# EAGLE design DeviceDIn8 (EAGLE 5.00)
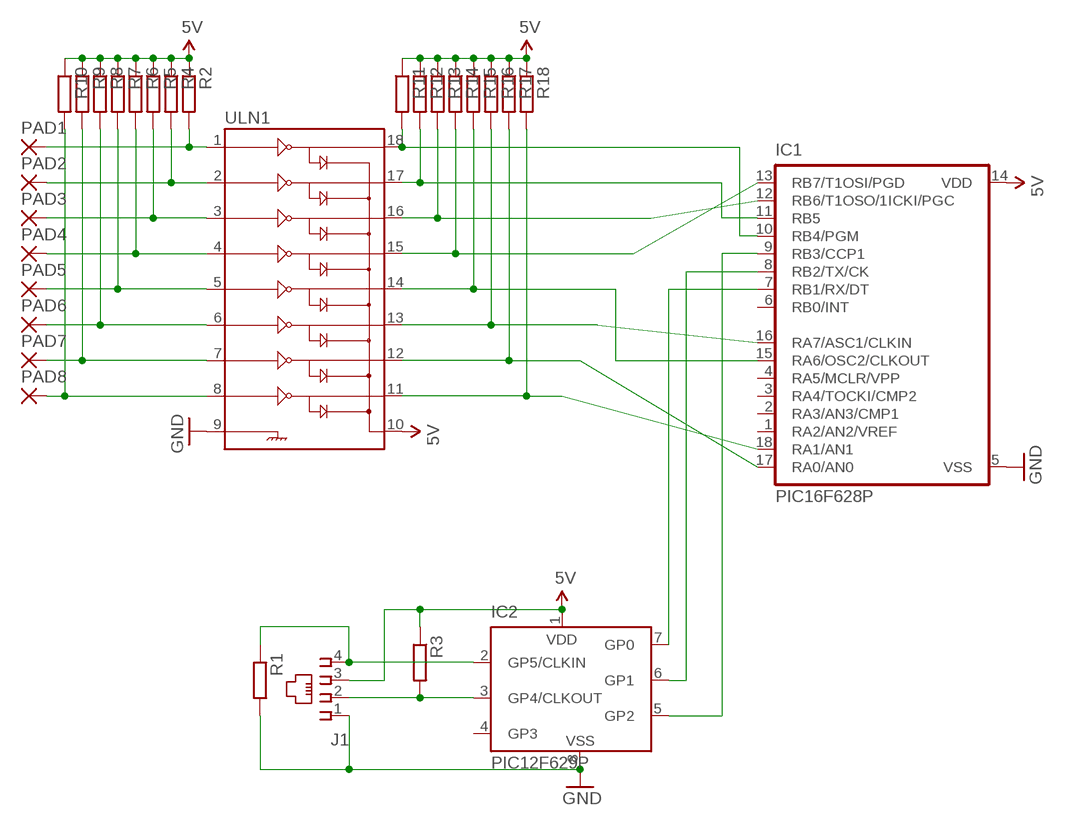
[diagram p0: schematic, sheet 1]

## Parts
IC1  PIC16F628P  [DIL18]
IC2  PIC12F629P  [DIL8]
J1  215875-3  [215875-3]
PAD1  2,15/1,0  [2,15/1,0]
PAD2  2,15/1,0  [2,15/1,0]
PAD3  2,15/1,0  [2,15/1,0]
PAD4  2,15/1,0  [2,15/1,0]
PAD5  2,15/1,0  [2,15/1,0]
PAD6  2,15/1,0  [2,15/1,0]
PAD7  2,15/1,0  [2,15/1,0]
PAD8  2,15/1,0  [2,15/1,0]
R1  R-EU_0204/5  [0204/5]
R2  R-EU_0204/5  [0204/5]
R3  R-EU_0204/5  [0204/5]
R4  R-EU_0204/5  [0204/5]
R5  R-EU_0204/7  [0204/7]
R6  R-EU_0207/10  [0207/10]
R7  R-EU_0207/10  [0207/10]
R8  R-EU_0204/7  [0204/7]
R9  R-EU_0204/5  [0204/5]
R10  R-EU_0204/5  [0204/5]
R11  R-EU_0204/5  [0204/5]
R12  R-EU_0204/5  [0204/5]
R13  R-EU_0204/7  [0204/7]
R14  R-EU_0207/10  [0207/10]
R15  R-EU_0207/10  [0207/10]
R16  R-EU_0204/7  [0204/7]
R17  R-EU_0204/5  [0204/5]
R18  R-EU_0204/5  [0204/5]
ULN1  ULN2803DIP  [DIL18]

## Nets
5V: IC1.14(VDD) IC2.1(VDD) J1.3 R2.1 R3.1 R4.1 R5.1 R6.1 R7.1 R8.1 R9.1 R10.1 R11.1 R12.1 R13.1 R14.1 R15.1 R16.1 R17.1 R18.1 ULN1.10
GND: IC1.5(VSS) IC2.8(VSS) J1.1 R1.2 ULN1.9
N$1: PAD6.1(P) R8.2 ULN1.6
N$2: PAD7.1(P) R9.2 ULN1.7
N$3: PAD1.1(P) R2.2 ULN1.1
N$4: PAD2.1(P) R4.2 ULN1.2
N$5: PAD3.1(P) R5.2 ULN1.3
N$6: PAD4.1(P) R6.2 ULN1.4
N$7: PAD5.1(P) R7.2 ULN1.5
N$8: PAD8.1(P) R10.2 ULN1.8
N$10: IC1.11(RB5) R12.2 ULN1.17
N$11: IC2.3(GP4/CLKOUT) J1.2 R3.2
N$12: IC1.12(RB6/T1OSO/1ICKI/PGC) R13.2 ULN1.16
N$13: IC1.13(RB7/T1OSI/PGD) R14.2 ULN1.15
N$14: IC1.15(RA6/OSC2/CLKOUT) R15.2 ULN1.14
N$15: IC1.16(RA7/ASC1/CLKIN) R16.2 ULN1.13
N$16: IC1.17(RA0/AN0) R17.2 ULN1.12
N$17: IC1.18(RA1/AN1) R18.2 ULN1.11
N$18: IC1.10(RB4/PGM) R11.2 ULN1.18
N$20: IC1.7(RB1/RX/DT) IC2.7(GP0)
N$21: IC1.8(RB2/TX/CK) IC2.6(GP1)
N$22: IC1.9(RB3/CCP1) IC2.5(GP2)
N$25: IC2.2(GP5/CLKIN) J1.4 R1.1
Unconnected: IC1.1(RA2/AN2/VREF) IC1.2(RA3/AN3/CMP1) IC1.3(RA4/TOCKI/CMP2) IC1.4(RA5/MCLR/VPP) IC1.6(RB0/INT) IC2.4(GP3)

## Library data of the parts
IC1 = microchip:PIC16*F62: FLASH-Based 8-Bit CMOS Microcontroller Source: http://ww1.microchip.com/downloads/en/DeviceDoc/40300C.pdf
IC2 = microchip:PIC12F6*: Data Sheet 8-Pin FLASH-Based 8-Bit CMOS Microcontrollers Source: http://www.microchip.com .. 41190c.pdf
J1 = con-amp:215875-3: AMP connector
PAD1-PAD8 = wirepad:2,15/1,0: THROUGH-HOLE PAD
R1-R18 = resistor:R-EU_: RESISTOR, European symbol
ULN1 = SparkFun:ULN2803: Darlington Driver ULN2803 Darlington array. 500mA max per channel, 8-channel package. Spark Fun Electronics SKU : COM-00312

## Board
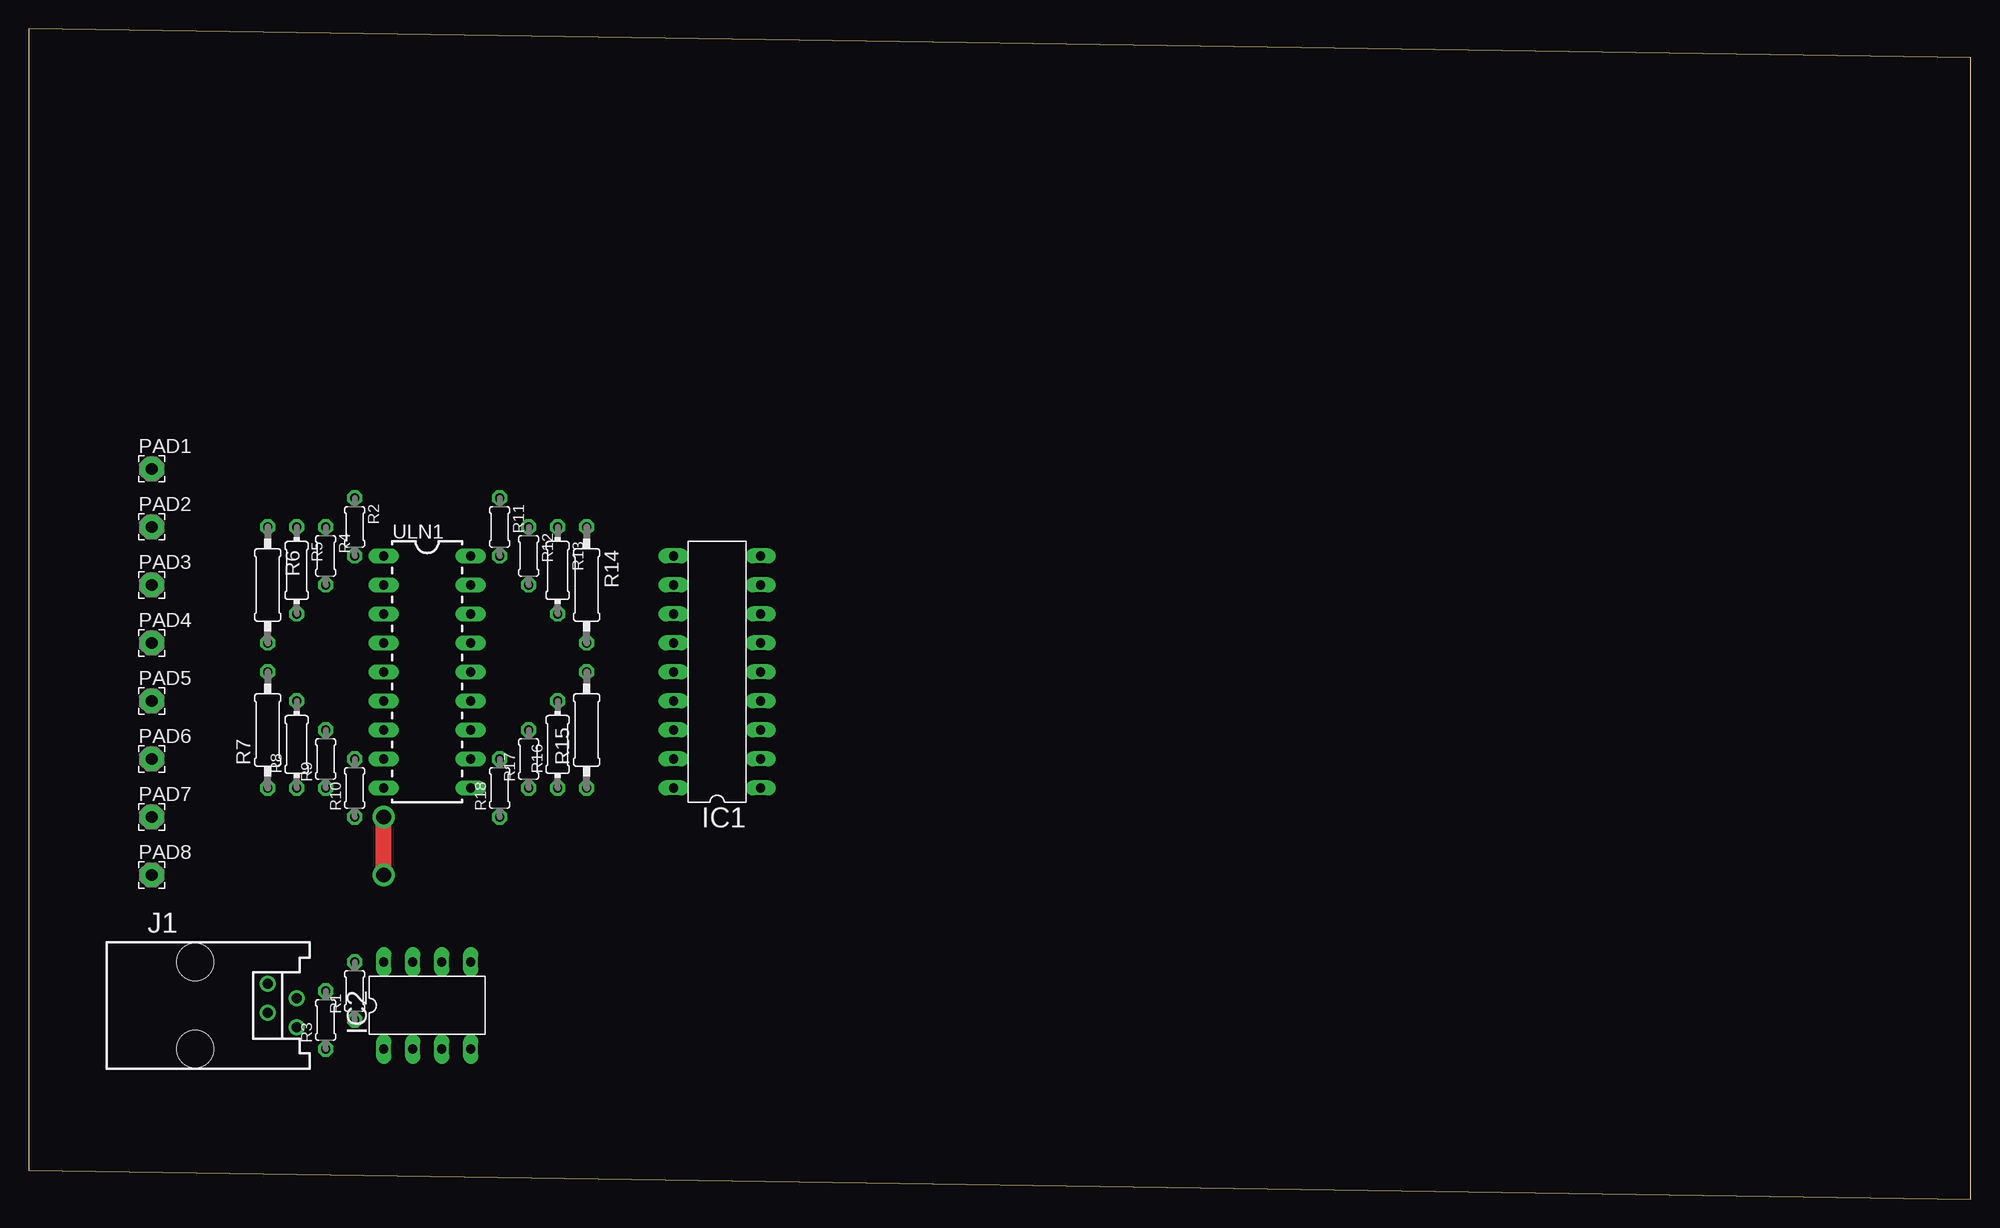
[diagram p1: board, top side]
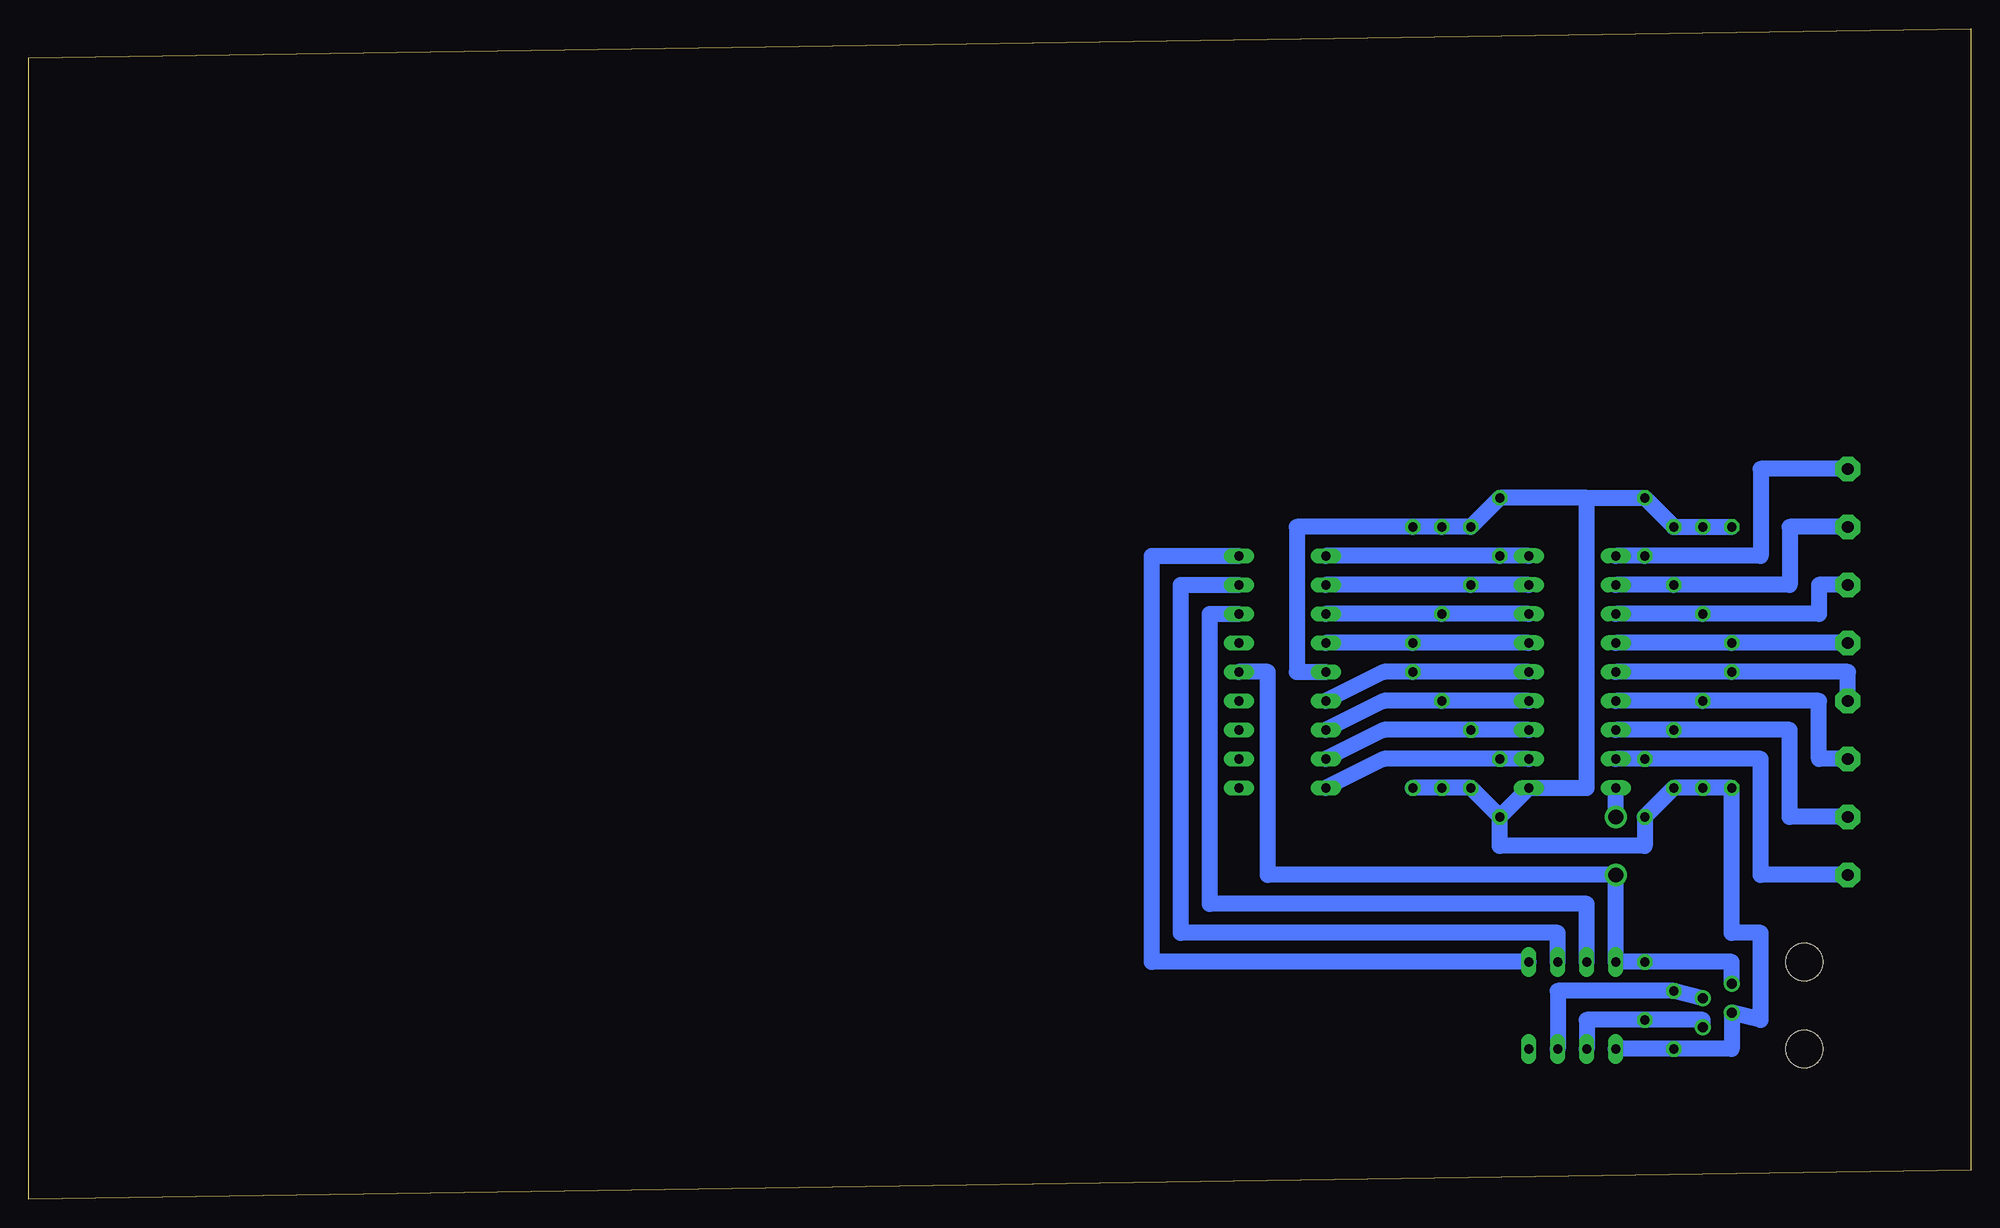
[diagram p2: board, bottom side, seen from below]

Size 170.16 x 102.54 mm. Coordinates in mm from the lower left corner, seen from the top.
Outline: 0,2.54 170.16,0 170.16,100 0,102.54 0,2.54
Copper layers (1*16): Top 0.035mm / dielectric 1.5mm / Bottom 0.035mm
Design rules "default": minimum track width 10mil, minimum drill 24mil, track to track 8mil, track to pad 8mil, pad to pad 8mil, via to via 8mil, smd to smd 8mil, copper to edge 40mil, drill to drill 8mil, minimum pad ring 10mil, minimum via ring 8mil, stop-mask expansion 4mil, vias tented up to drill 0mil, thermal gap 10mil

### Footprints (pad centres in the part's own frame; a part is rotated, then mirrored left to right if it is on the bottom)
DIL18 = drill 0.813 long: 1 -10.16,-3.81; 2 -7.62,-3.81; 3 -5.08,-3.81; 4 -2.54,-3.81; 5 0,-3.81; 6 2.54,-3.81; 7 5.08,-3.81; 8 7.62,-3.81; 9 10.16,-3.81; 10 10.16,3.81; 11 7.62,3.81; 12 5.08,3.81; 13 2.54,3.81; 14 0,3.81; 15 -2.54,3.81; 16 -5.08,3.81; 17 -7.62,3.81; 18 -10.16,3.81
DIL8 = drill 0.813 long: 1 -3.81,-3.81; 2 -1.27,-3.81; 3 1.27,-3.81; 4 3.81,-3.81; 5 3.81,3.81; 6 1.27,3.81; 7 -1.27,3.81; 8 -3.81,3.81
215875-3 = drill 0.889 round: 1 -1.905,6.35; 2 -0.635,8.89; 3 0.635,6.35; 4 1.905,8.89 | hole 3.251: -3.81,0; 3.81,0
2,15/1,0 = drill 1.016 pad 2.159 octagon: 1 0,0
0204/5 = drill 0.813 octagon: 1 -2.54,0; 2 2.54,0
0204/7 = drill 0.813 octagon: 1 -3.81,0; 2 3.81,0
0207/10 = drill 0.813 octagon: 1 -5.08,0; 2 5.08,0

### Placement (x,y rotation side)
IC1  60.32,46.19 90 top
IC2  34.92,16.98 0 top
J1  14.6,16.98 270 top
PAD1  10.79,63.97 0 top
PAD2  10.79,58.89 0 top
PAD3  10.79,53.81 0 top
PAD4  10.79,48.73 0 top
PAD5  10.79,43.65 0 top
PAD6  10.79,38.57 0 top
PAD7  10.79,33.49 0 top
PAD8  10.79,28.41 0 top
R1  28.57,18.25 90 top
R2  28.57,58.89 270 top
R3  26.03,15.71 90 top
R4  26.03,56.35 270 top
R5  23.49,55.08 270 top
R6  20.95,53.81 270 top
R7  20.95,41.11 90 top
R8  23.49,39.84 90 top
R9  26.03,38.57 90 top
R10  28.57,36.03 90 top
R11  41.27,58.89 270 top
R12  43.81,56.35 270 top
R13  46.35,55.08 270 top
R14  48.89,53.81 270 top
R15  48.89,41.11 90 top
R16  46.35,39.84 90 top
R17  43.81,38.57 90 top
R18  41.27,36.03 90 top
ULN1  34.92,46.19 270 top

### Tracks (layer width: path | path; a pad name or v marks a point on that pad's centre or on a via)
5V
  Bottom 1.422: R4.1 R5.1 R6.1 R4.1 | R2.1 R4.1 | 33.65,61.43 R11.1 R12.1 R13.1 R14.1 59.05,58.89 59.05,46.19 IC1.14 | R2.1 R4.1 | 33.65,61.43 R2.1 | 33.65,61.43 33.65,36.03 ULN1.10 R18.1 | R18.1 41.27,30.95 28.57,30.95 R10.1 R9.1 R8.1 R7.1 20.95,23.33 18.41,23.33 18.41,15.71 J1.3 20.95,13.17 R3.1 IC2.1 | R18.1 R17.1 R16.1 R15.1
GND  (via drill 1.3)
  Top 1.422: v31.11,28.41 v31.11,33.49
  Bottom 1.422: IC1.5 61.59,46.19 61.59,28.41 v31.11,28.41 31.11,25.87 IC2.8 R1.2 20.95,20.79 J1.1 | v31.11,33.49 ULN1.9
N$1
  Bottom 1.422: ULN1.6 R8.2 13.33,43.65 13.33,38.57 PAD6.1
N$2
  Bottom 1.422: PAD7.1 15.87,33.49 15.87,41.11 R9.2 ULN1.7
N$3
  Bottom 1.422: ULN1.1 R2.2 18.41,56.35 18.41,63.97 PAD1.1
N$4
  Bottom 1.422: ULN1.2 R4.2 15.87,53.81 15.87,58.89 PAD2.1
N$5
  Bottom 1.422: ULN1.3 R5.2 13.33,51.27 13.33,53.81 PAD3.1
N$6
  Bottom 1.422: ULN1.4 R6.2 PAD4.1
N$7
  Bottom 1.422: ULN1.5 R7.2 10.79,46.19 PAD5.1
N$8
  Bottom 1.422: ULN1.8 R10.2 18.41,38.57 18.41,28.41 PAD8.1
N$10
  Bottom 1.422: ULN1.17 R12.2 IC1.11
N$11
  Bottom 1.422: J1.2 R3.2 36.19,18.25 IC2.3
N$12
  Bottom 1.422: ULN1.16 R13.2 IC1.12
N$13
  Bottom 1.422: ULN1.15 R14.2 IC1.13
N$14
  Bottom 1.422: ULN1.14 R15.2 51.43,46.19 IC1.15
N$15
  Bottom 1.422: ULN1.13 R16.2 51.43,43.65 IC1.16
N$16
  Bottom 1.422: ULN1.12 R17.2 51.43,41.11 IC1.17
N$17
  Bottom 1.422: ULN1.11 R18.2 51.43,38.57 IC1.18
N$18
  Bottom 1.422: ULN1.18 R11.2 IC1.10
N$20
  Bottom 1.422: IC2.7 33.65,25.87 66.67,25.87 66.67,51.27 IC1.7
N$21
  Bottom 1.422: IC2.6 36.19,23.33 69.21,23.33 69.21,53.81 IC1.8
N$22
  Bottom 1.422: IC2.5 71.75,20.79 71.75,56.35 IC1.9
N$25
  Bottom 1.422: IC2.2 33.65,15.71 R1.1 23.49,15.71 J1.4